# EasyEDA Pro project 无线充电接收端.epro, board 无线充电接收V2.0
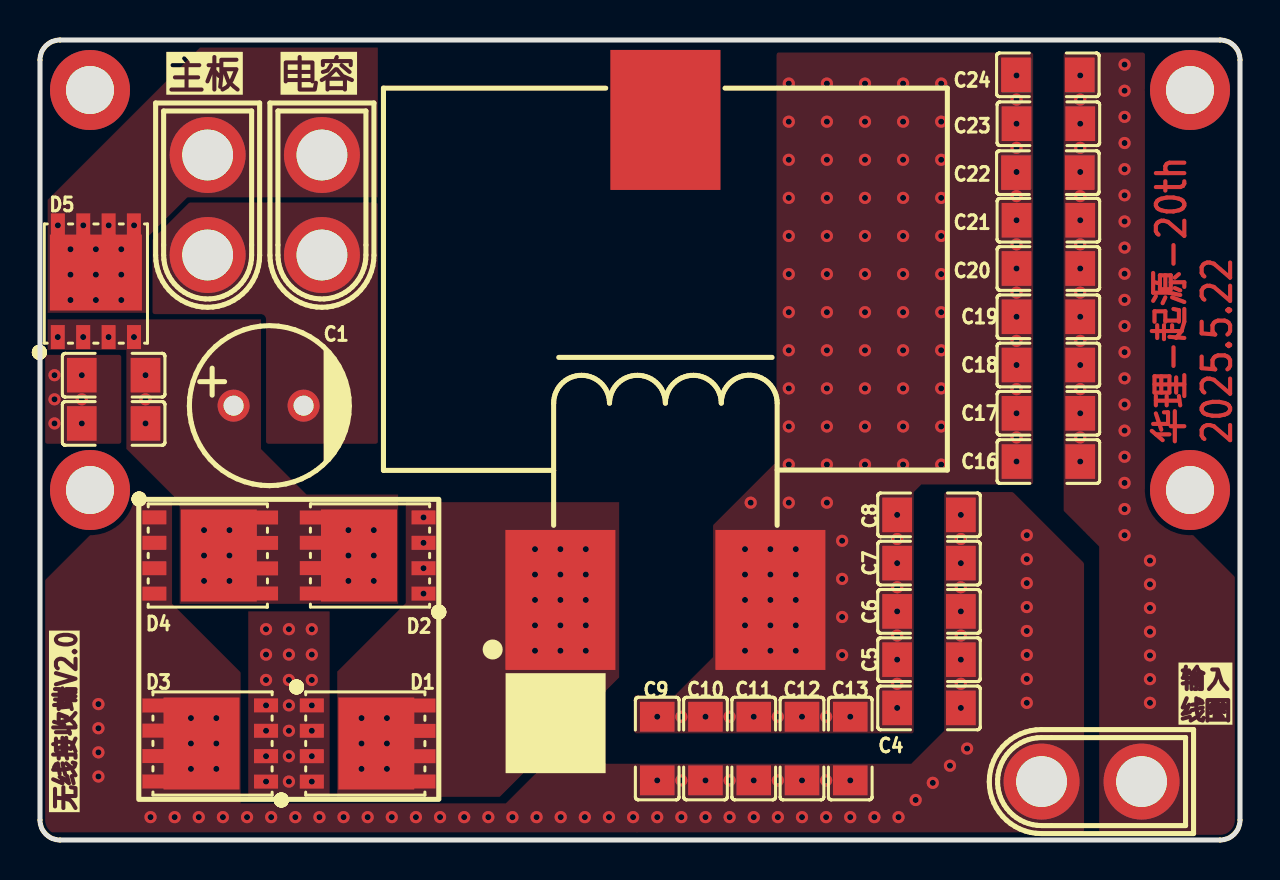
[diagram p8: board, top side]
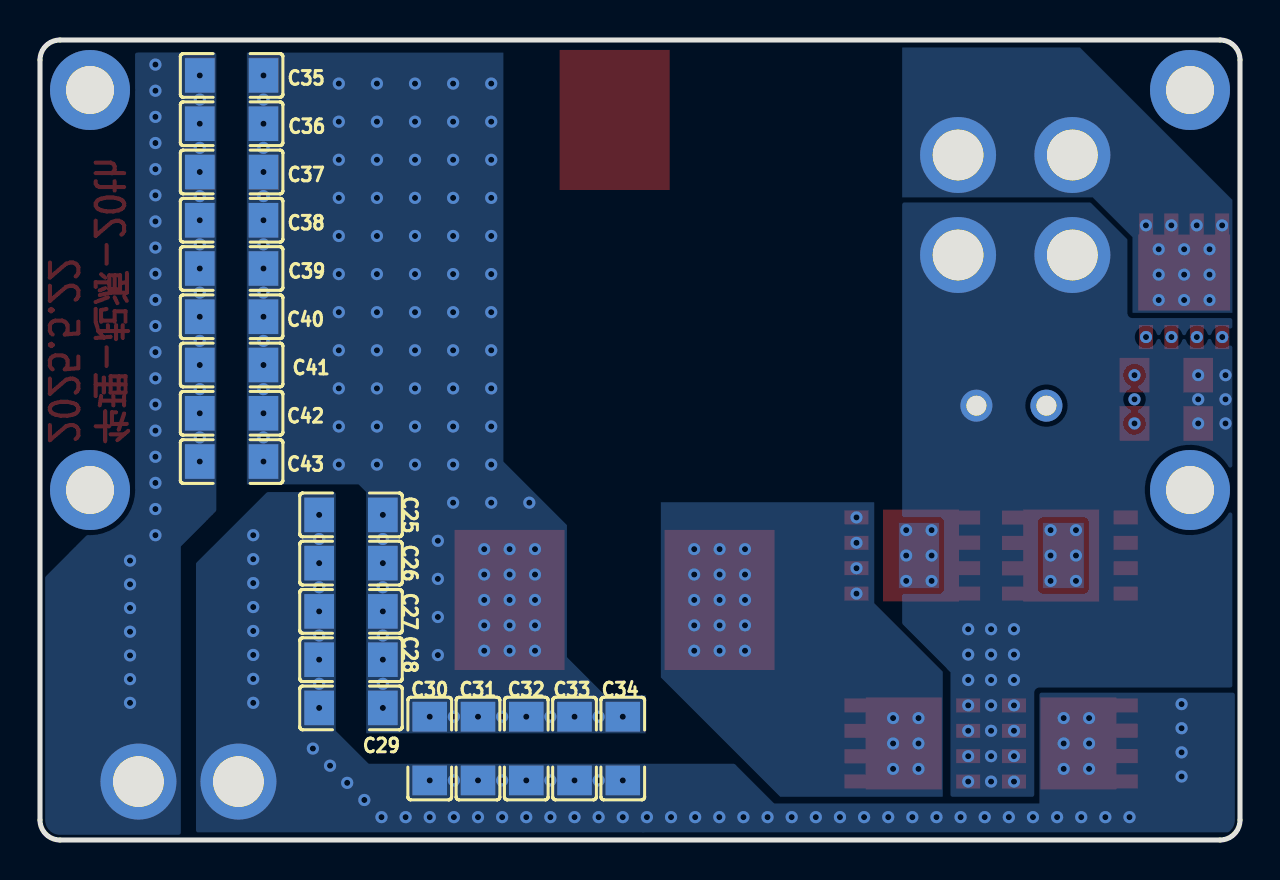
[diagram p9: board, bottom side, seen from below]

Outline 60 x 40 mm; copper layers: Top Layer, Inner1, Inner2, Bottom Layer. Coordinates in mm from the lower left corner of the outline.
Outline path: 0,39 0,1 arc(0.29,0.29) 1,0 59,0 arc(59.71,0.29) 60,1 60,39 arc(59.71,39.71) 59,40 1,40 arc(0.29,39.71) 0,39
Stack: Top Layer 0.035mm 外层铜厚1oz / Dielectric1 0.2104mm 7628 RC49% 8.6mil / Inner1 0.0152mm 内层铜厚 / Dielectric2 1.065mm 1.1mm H/HOZ Copper / Inner2 0.0152mm 内层铜厚 / Dielectric3 0.2104mm 7628 RC49% 8.6mil / Bottom Layer 0.035mm 外层铜厚1oz

## Design rules (mm)
template: xyf_v1.1
spacing copperThickness1oz (default): track to track 0.102, other pairs 0.152 to 0.3
spacing copperThickness2oz: track to track 0.203, other pairs 0.152 to 0.3
spacing 0焊盘板框间距: track to track 0.152, other pairs 0 to 0.3
spacing copperThicknessInner0.5oz: track to track 0.089, other pairs 0.152 to 0.3
track width copperThickness1oz (default): min 0.127, default 0.254, max 2.54
track width copperThickness2oz: min 0.203, default 0.254, max 2.54
track width copperThickness0.5oz: min 0.089, default 0.254, max 2.54
differential pair differentialPair (default): width min 0.127, default 0.254, max 2.54; gap min 0.152, default 0.152
via viaSize (default): diameter min 0.5, default 0.61, max 10; hole min 0.3, default 0.305, max 6.3
via viaSize2: diameter min 0.5, default 0.61, max 10; hole min 0.3, default 0.305, max 6.299
via viaSize4: diameter min 0.45, default 0.61, max 10; hole min 0.3, default 0.305, max 6.299

## Placement (name value [footprint] x y rotation side)
C1  680uF  [CAP-TH_BD8.0-P3.50-D0.6-FD]  11.43 21.72 0 top
C2  100nF  [C1206]  3.68 23.24 0 top
C3  100nF  [C1206]  3.68 20.83 0 top
C4  68nF  [C1206]  44.45 6.6 0 top
C5  68nF  [C1206]  44.45 9.02 0 top
C6  68nF  [C1206]  44.45 11.43 0 top
C7  10nF  [C1206]  44.45 13.84 180 top
C8  10nF  [C1206]  44.45 16.26 180 top
C9  10nF  [C1206]  30.86 4.57 90 top
C10  10nF  [C1206]  33.27 4.57 90 top
C11  4.3nF  [C1206]  35.69 4.57 90 top
C12  4.3nF  [C1206]  38.1 4.57 90 top
C13  1nF  [C1206]  40.51 4.57 90 top
C16  10nF  [C1206]  50.42 18.92 0 top
C17  10nF  [C1206]  50.42 21.34 0 top
C18  10nF  [C1206]  50.42 23.75 0 top
C19  4.3nF  [C1206]  50.42 26.16 0 top
C20  4.3nF  [C1206]  50.42 28.58 0 top
C21  4.3nF  [C1206]  50.42 30.99 0 top
C22  1nF  [C1206]  50.39 33.37 0 top
C23  1nF  [C1206]  50.42 35.81 0 top
C24  1nF  [C1206]  50.39 38.26 0 top
C25  68nF  [C1206]  44.45 16.26 0 bottom
C26  68nF  [C1206]  44.45 13.84 0 bottom
C27  68nF  [C1206]  44.45 11.43 0 bottom
C28  10nF  [C1206]  44.45 9.02 180 bottom
C29  10nF  [C1206]  44.45 6.6 180 bottom
C30  10nF  [C1206]  40.51 4.57 90 bottom
C31  10nF  [C1206]  38.1 4.57 90 bottom
C32  4.3nF  [C1206]  35.69 4.57 90 bottom
C33  4.3nF  [C1206]  33.27 4.57 90 bottom
C34  1nF  [C1206]  30.86 4.57 90 bottom
C35  10nF  [C1206]  50.42 38.23 0 bottom
C36  10nF  [C1206]  50.42 35.81 0 bottom
C37  10nF  [C1206]  50.42 33.4 0 bottom
C38  4.3nF  [C1206]  50.42 30.99 0 bottom
C39  4.3nF  [C1206]  50.42 28.58 0 bottom
C40  4.3nF  [C1206]  50.42 26.16 0 bottom
C41  1nF  [C1206]  50.42 23.75 0 bottom
C42  1nF  [C1206]  50.42 21.34 0 bottom
C43  1nF  [C1206]  50.42 18.92 0 bottom
CN1  XT30U-M  [CONN-TH_XT30U-M]  52.58 2.92 180 top
CN2  XT30U-M  [CONN-TH_XT30U-M]  8.38 31.75 270 top
CN3  XT30U-M  [CONN-TH_XT30U-M]  14.1 31.75 270 top
D1  STPS30M100DJF-TR  [PDFN-8_L5.8-W4.9-P1.27-LS6.1-BL]  16.38 4.83 270 top
D2  STPS30M100DJF-TR  [PDFN-8_L5.8-W4.9-P1.27-LS6.1-BL]  16.38 14.22 90 top
D3  STPS30M100DJF-TR  [PDFN-8_L5.8-W4.9-P1.27-LS6.1-BL]  8.51 4.83 90 top
D4  STPS30M100DJF-TR  [PDFN-8_L5.8-W4.9-P1.27-LS6.1-BL]  8.51 14.22 270 top
D5  STPS30M100DJF-TR  [PDFN-8_L5.8-W4.9-P1.27-LS6.1-BL]  2.79 27.94 0 top
L1  4.7uH  [IND-SMD_3P-L28.0-W19.0-LS27.0]  31.27 24 0 top
QR1  -  [JLC-QRCODE-5x5]  25.78 5.84 0 top
SCREW1  -  [M2螺丝（2.35）]  2.5 37.5 0 top
SCREW2  -  [M2螺丝（2.35）]  57.5 37.5 0 top
SCREW3  -  [M2螺丝（2.35）]  2.5 17.5 0 top
SCREW4  -  [M2螺丝（2.35）]  57.5 17.5 0 top

## Footprints (pads in the part's own frame, mm; a bottom-side part is the same pattern mirrored in y, then rotated)
C1206
  rect 1.485x1.728 smd: 1(-1.593,0) 2(1.593,0)
CAP-TH_BD8.0-P3.50-D0.6-FD
  round 1.6 hole 1: 1(-1.75,0) 2(1.75,0)
CONN-TH_XT30U-M
  round 3.8 hole 2.54: 1(-2.5,0) 2(2.5,0)
IND-SMD_3P-L28.0-W19.0-LS27.0
  rect 5.5x7 smd: 1(-5.25,-12) 2(5.25,-12) 3(0,12)
M2螺丝（2.35）
  round 4 hole 2.4x2.35: 1(0,0)
PDFN-8_L5.8-W4.9-P1.27-LS6.1-BL
  rect 0.7x1.2 smd: 1(-1.905,-2.792) 2(-0.635,-2.792) 3(0.635,-2.792) 4(1.905,-2.792) 5(1.9,2.792) 6(0.64,2.792) 7(-0.63,2.792) 8(-1.9,2.792)
  rect 4.6x3.8 smd: 9(0,0.432)

## Nets
As in the schematic.

Pads without a net: L1 3; SCREW1 1; SCREW2 1; SCREW3 1; SCREW4 1

## Via types
v1: diameter 0.61, hole 0.305, Top Layer to Bottom Layer, 311 vias

## Routing (per net, layer and track width the routed paths; a pad name or vN(x,y) marks a point on that pad's centre or on a via; arc(x,y) is an arc through that point)
GND:
  vias: v1(0.72,23.24) v1(0.72,22.03) v1(0.72,20.83) v1(2.09,23.24) v1(2.09,22.03) v1(2.09,20.83) v1(11.3,10.54) v1(11.3,9.27) v1(11.3,8) v1(11.3,6.73) v1(11.3,5.46) v1(11.3,4.19) v1(11.3,2.92) v1(12.45,10.54) v1(12.45,9.27) v1(12.45,8) v1(12.45,6.73) v1(12.45,5.46) v1(12.45,4.19) v1(12.45,2.92) v1(13.59,10.54) v1(13.59,9.27) v1(13.59,8) v1(13.59,6.73) v1(13.59,5.46) v1(13.59,4.19) v1(13.59,2.92)
VCAP:
  vias: v1(0.89,30.73) v1(1.52,29.54) v1(1.52,28.27) v1(1.52,27) v1(2.16,30.73) v1(2.79,29.54) v1(2.79,28.27) v1(2.79,27) v1(3.43,30.73) v1(4.06,29.54) v1(4.06,28.27) v1(4.06,27) v1(4.7,30.73)
$1N505:
  vias: v1(2.92,6.79) v1(2.92,5.59) v1(2.92,4.38) v1(2.92,3.17) v1(5.53,1.14) v1(6.73,1.14) v1(7.55,6.1) v1(7.55,4.83) v1(7.55,3.56) v1(7.94,1.14) v1(8.82,6.1) v1(8.82,4.83) v1(8.82,3.56) v1(9.15,1.14) v1(10.35,1.14) v1(11.56,1.14) v1(12.76,1.14) v1(13.97,1.14) v1(15.18,1.14) v1(16.38,1.14) v1(17.59,1.14) v1(18.8,1.14) v1(20,1.14) v1(21.21,1.14) v1(22.42,1.14) v1(23.62,1.14) v1(24.83,1.14) v1(26.04,1.14) v1(27.24,1.14) v1(28.45,1.14) v1(29.66,1.14) v1(30.86,2.98) v1(30.86,1.14) v1(32.07,2.98) v1(32.07,1.14) v1(33.27,2.98) v1(33.27,1.14) v1(34.48,2.98) v1(34.48,1.14) v1(35.69,2.98) v1(35.69,1.14) v1(36.89,2.98) v1(36.89,1.14) v1(38.1,2.98) v1(38.1,1.14) v1(39.31,2.98) v1(39.31,1.14) v1(40.51,2.98) v1(40.51,1.14) v1(41.72,1.14) v1(42.93,1.14) v1(43.78,2) v1(44.64,2.86) v1(45.5,3.72) v1(46.04,16.26) v1(46.04,15.05) v1(46.04,13.84) v1(46.04,12.64) v1(46.04,11.43) v1(46.04,10.22) v1(46.04,9.02) v1(46.04,7.81) v1(46.04,6.6) v1(46.35,4.57) v1(49.34,15.24) v1(49.34,14.04) v1(49.34,12.84) v1(49.34,11.65) v1(49.34,10.45) v1(49.34,9.25) v1(49.34,8.06) v1(49.34,6.86)
$1N630:
  vias: v1(16.08,6.1) v1(16.08,4.83) v1(16.08,3.56) v1(17.35,6.1) v1(17.35,4.83) v1(17.35,3.56) v1(19.18,16.13) v1(19.18,14.86) v1(19.18,13.59) v1(19.18,12.32) v1(24.75,14.54) v1(24.75,13.27) v1(24.75,12) v1(24.75,10.73) v1(24.75,9.46) v1(26.02,14.54) v1(26.02,13.27) v1(26.02,12) v1(26.02,10.73) v1(26.02,9.46) v1(27.29,14.54) v1(27.29,13.27) v1(27.29,12) v1(27.29,10.73) v1(27.29,9.46)
$1N944:
  vias: v1(0.89,25.15) v1(2.16,25.15) v1(3.43,25.15) v1(4.7,25.15) v1(5.28,23.24) v1(5.28,22.03) v1(5.28,20.83) v1(8.2,15.49) v1(8.2,14.22) v1(8.2,12.95) v1(9.47,15.49) v1(9.47,14.22) v1(9.47,12.95) v1(15.42,15.49) v1(15.42,14.22) v1(15.42,12.95) v1(16.69,15.49) v1(16.69,14.22) v1(16.69,12.95)
$1N10317:
  vias: v1(30.86,6.16) v1(32.07,6.16) v1(33.27,6.16) v1(34.48,6.16) v1(35.25,14.54) v1(35.25,13.27) v1(35.25,12) v1(35.25,10.73) v1(35.25,9.46) v1(35.53,16.87) v1(35.69,6.16) v1(36.52,14.54) v1(36.52,13.27) v1(36.52,12) v1(36.52,10.73) v1(36.52,9.46) v1(36.89,6.16) v1(37.44,37.82) v1(37.44,35.92) v1(37.44,34.01) v1(37.44,32.11) v1(37.44,30.2) v1(37.44,28.3) v1(37.44,26.39) v1(37.44,24.49) v1(37.44,22.58) v1(37.44,20.68) v1(37.44,18.77) v1(37.44,16.87) v1(37.79,14.54) v1(37.79,13.27) v1(37.79,12) v1(37.79,10.73) v1(37.79,9.46) v1(38.1,6.16) v1(39.34,37.82) v1(39.34,35.92) v1(39.34,34.01) v1(39.34,32.11) v1(39.34,30.2) v1(39.34,28.3) v1(39.34,26.39) v1(39.34,24.49) v1(39.34,22.58) v1(39.34,20.68) v1(39.34,18.77) v1(39.34,16.87) v1(39.31,6.16) v1(40.11,14.96) v1(40.11,13.06) v1(40.11,11.15) v1(40.11,9.25) v1(40.51,6.16) v1(41.25,37.82) v1(41.25,35.92) v1(41.25,34.01) v1(41.25,32.11) v1(41.25,30.2) v1(41.25,28.3) v1(41.25,26.39) v1(41.25,24.49) v1(41.25,22.58) v1(41.25,20.68) v1(41.25,18.77) v1(42.86,16.26) v1(42.86,15.05) v1(42.86,13.84) v1(42.86,12.64) v1(42.86,11.43) v1(42.86,10.22) v1(42.86,9.02) v1(42.86,7.81) v1(42.86,6.6) v1(43.15,37.82) v1(43.15,35.92) v1(43.15,34.01) v1(43.15,32.11) v1(43.15,30.2) v1(43.15,28.3) v1(43.15,26.39) v1(43.15,24.49) v1(43.15,22.58) v1(43.15,20.68) v1(43.15,18.77) v1(45.06,37.82) v1(45.06,35.92) v1(45.06,34.01) v1(45.06,32.11) v1(45.06,30.2) v1(45.06,28.3) v1(45.06,26.39) v1(45.06,24.49) v1(45.06,22.58) v1(45.06,20.68) v1(45.06,18.77) v1(48.83,38.23) v1(48.83,37.02) v1(48.83,35.81) v1(48.83,34.61) v1(48.83,33.4) v1(48.83,32.19) v1(48.83,30.99) v1(48.83,29.78) v1(48.83,28.58) v1(48.83,27.37) v1(48.83,26.16) v1(48.83,24.96) v1(48.83,23.75) v1(48.83,22.54) v1(48.83,21.34) v1(48.83,20.13) v1(48.83,18.92)
$1N10703:
  vias: v1(52.01,38.23) v1(52.01,37.02) v1(52.01,35.81) v1(52.01,34.61) v1(52.01,33.4) v1(52.01,32.19) v1(52.01,30.99) v1(52.01,29.78) v1(52.01,28.58) v1(52.01,27.37) v1(52.01,26.16) v1(52.01,24.96) v1(52.01,23.75) v1(52.01,22.54) v1(52.01,21.34) v1(52.01,20.13) v1(52.01,18.92) v1(54.23,38.77) v1(54.23,37.46) v1(54.23,36.16) v1(54.23,34.85) v1(54.23,33.54) v1(54.23,32.23) v1(54.23,30.93) v1(54.23,29.62) v1(54.23,28.31) v1(54.23,27.01) v1(54.23,25.7) v1(54.23,24.39) v1(54.23,23.08) v1(54.23,21.78) v1(54.23,20.47) v1(54.23,19.16) v1(54.23,17.85) v1(54.23,16.55) v1(54.23,15.24) v1(55.5,13.97) v1(55.5,12.78) v1(55.5,11.6) v1(55.5,10.41) v1(55.5,9.23) v1(55.5,8.04) v1(55.5,6.86)

## Copper pours and planes (outline as drawn; the poured copper is in the pictures)
GND on Top Layer: 10.41,11.43 14.48,11.43 14.48,2.16 10.41,2.16
GND on Top Layer: -0.51,41.91 16.89,41.91 16.89,19.81 -0.51,19.81
GND on Bottom Layer: 14.48,2.16 14.48,8.38 16.89,10.8 16.89,31.88 0.38,31.88 0.38,2.16
GND on Inner2: 14.48,2.16 14.48,8.38 16.89,10.8 16.89,31.88 0.38,31.88 0.38,2.16
VCAP on Top Layer: 0.38,39.62 16.89,39.62 16.89,26.36 0.38,26.36
VCAP on Bottom Layer: 0.38,39.62 16.89,39.62 16.89,26.36 0.38,26.36
VCAP on Inner1: 0.38,39.62 16.89,39.62 16.89,26.36 0.38,26.36
VCAP on Inner2: 0.38,39.62 16.89,39.62 16.89,26.36 0.38,26.36
$1N505 on Top Layer: 25.27,3.81 23.29,1.83 10.03,1.83 10.03,8.38 6.6,11.81 6.6,16.93 4.19,16.93 -1.52,11.22 -1.52,0.38 29.97,0.38 29.97,3.81
$1N505 on Top Layer: 52.2,0.38 52.2,13.84 48.64,17.4 45.21,17.4 45.21,5.46 43.56,3.81 29.72,3.81 29.72,0.38
$1N505 on Bottom Layer: 52.2,0.38 52.2,13.84 48.64,17.4 45.21,17.4 45.21,5.46 43.56,3.81 29.72,3.81 29.72,0.38
$1N505 on Bottom Layer: 25.27,3.81 23.29,1.83 10.03,1.83 10.03,7.37 -1.52,7.37 -1.52,0.38 29.97,0.38 29.97,3.81
$1N505 on Inner1: 25.27,3.81 23.29,1.83 10.03,1.83 10.03,7.37 -1.52,7.37 -1.52,0.38 29.97,0.38 29.97,3.81
$1N505 on Inner1: 52.2,0.38 52.2,13.84 48.64,17.4 45.21,17.4 45.21,5.46 43.56,3.81 29.72,3.81 29.72,0.38
$1N505 on Inner2: 25.27,3.81 23.29,1.83 10.03,1.83 10.03,7.37 -1.52,7.37 -1.52,0.38 29.97,0.38 29.97,3.81
$1N505 on Inner2: 52.2,0.38 52.2,13.84 48.64,17.4 45.21,17.4 45.21,5.46 43.56,3.81 29.72,3.81 29.72,0.38
$1N630 on Top Layer: 14.86,16.89 28.96,16.89 28.96,2.16 14.86,2.16
$1N630 on Bottom Layer: 14.86,16.89 28.96,16.89 28.96,2.16 14.86,2.16
$1N630 on Inner1: 14.86,16.89 28.96,16.89 28.96,2.16 14.86,2.16
$1N630 on Inner2: 14.86,16.89 28.96,16.89 28.96,2.16 14.86,2.16
$1N944 on Top Layer: 0.38,26.03 17.91,26.03 17.91,11.81 0.38,11.81
$1N944 on Bottom Layer: 7.82,15.88 9.85,15.88 9.85,12.57 7.82,12.57
$1N944 on Bottom Layer: 15.04,15.88 17.07,15.88 17.07,12.57 15.04,12.57
$1N944 on Inner1: 0.38,26.03 17.91,26.03 17.91,11.81 0.38,11.81
$1N944 on Inner2: 15.04,15.88 17.07,15.88 17.07,12.57 15.04,12.57
$1N944 on Inner2: 7.82,15.88 9.85,15.88 9.85,12.57 7.82,12.57
$1N10317 on Top Layer: 36.83,39.37 36.83,18.92 33.66,15.75 33.66,9.14 31.75,7.24 29.72,7.24 29.72,5.33 43.69,5.33 43.69,17.4 44.07,17.78 49.66,17.78 49.66,39.37
$1N10317 on Bottom Layer: 29.72,39.37 49.66,39.37 49.66,5.33 29.72,5.33
$1N10317 on Inner1: 29.72,39.37 49.66,39.37 49.66,5.33 29.72,5.33
$1N10317 on Inner2: 29.72,39.37 49.66,39.37 49.66,5.33 29.72,5.33
$1N10703 on Top Layer: 61.98,-1.14 61.98,10.92 55.25,17.65 55.25,39.37 51.18,39.37 51.18,16.46 52.96,14.68 52.96,-1.14
$1N10703 on Bottom Layer: 61.98,-1.14 61.98,10.92 55.25,17.65 55.25,39.37 51.18,39.37 51.18,16.46 52.96,14.68 52.96,-1.14
$1N10703 on Inner1: 61.98,-1.14 61.98,10.92 55.25,17.65 55.25,39.37 51.18,39.37 51.18,16.46 52.96,14.68 52.96,-1.14
$1N10703 on Inner2: 61.98,-1.14 61.98,10.92 55.25,17.65 55.25,39.37 51.18,39.37 51.18,16.46 52.96,14.68 52.96,-1.14

## Text on the board
Top Layer: 华理-起源-20th / 2025.5.22
Top Silkscreen Layer: 输入 / 线圈 | 无线接收端V2.0 | 主板 | 电容
